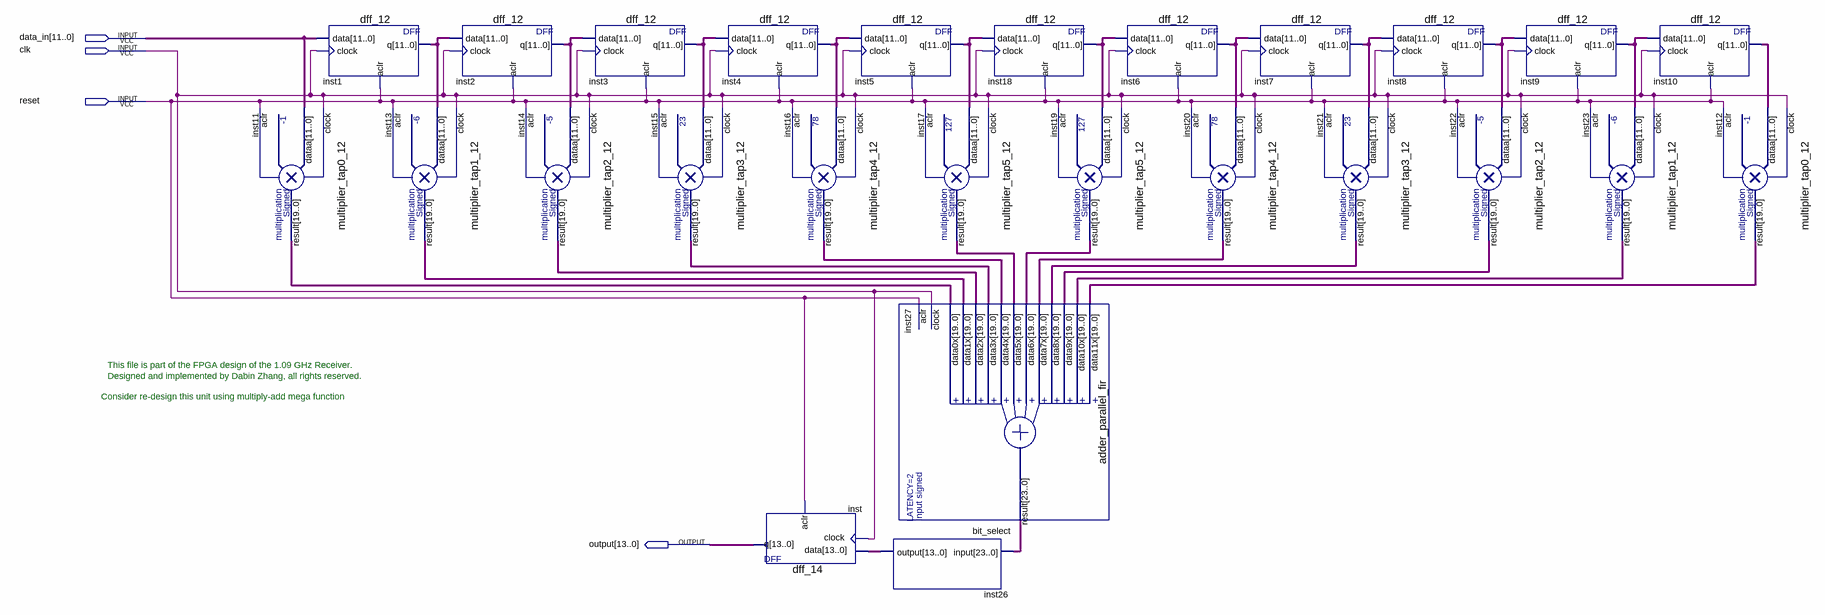
[diagram p0: schematic sheet]
// Quartus schematic fir.bdf as structural Verilog: 26 symbols, 4 pins
module fir (
  input  [11:0] data_in,
  input  clk,
  input  reset,
  output [13:0] \output 
);

  wire [11:0] inst1_q, inst2_q, inst3_q, inst4_q, inst5_q, inst6_q, inst7_q, inst8_q, inst9_q, inst10_q,
       inst18_q;
  wire [13:0] inst26_output;
  wire [19:0] inst11_result, inst12_result, inst13_result, inst14_result, inst15_result, inst16_result,
       inst17_result, inst19_result, inst20_result, inst21_result, inst22_result, inst23_result;
  wire [23:0] inst27_result;

  multiplier_tap0_12 inst11 (.dataa(data_in), .clock(clk), .aclr(reset), .result(inst11_result));
  dff_12 inst1 (.data(data_in), .clock(clk), .aclr(reset), .q(inst1_q));
  multiplier_tap1_12 inst13 (.dataa(inst1_q), .clock(clk), .aclr(reset), .result(inst13_result));
  dff_12 inst2 (.data(inst1_q), .clock(clk), .aclr(reset), .q(inst2_q));
  multiplier_tap2_12 inst14 (.dataa(inst2_q), .clock(clk), .aclr(reset), .result(inst14_result));
  dff_12 inst3 (.data(inst2_q), .clock(clk), .aclr(reset), .q(inst3_q));
  multiplier_tap3_12 inst15 (.dataa(inst3_q), .clock(clk), .aclr(reset), .result(inst15_result));
  dff_12 inst4 (.data(inst3_q), .clock(clk), .aclr(reset), .q(inst4_q));
  multiplier_tap4_12 inst16 (.dataa(inst4_q), .clock(clk), .aclr(reset), .result(inst16_result));
  dff_14 inst (.data(inst26_output), .clock(clk), .aclr(reset), .q(\output ));
  dff_12 inst5 (.data(inst4_q), .clock(clk), .aclr(reset), .q(inst5_q));
  bit_select inst26 (.\input (inst27_result), .\output (inst26_output));
  multiplier_tap5_12 inst17 (.dataa(inst5_q), .clock(clk), .aclr(reset), .result(inst17_result));
  adder_parallel_fir inst27 (
    .data11x(inst12_result), .data10x(inst23_result), .data9x(inst22_result), .data8x(inst21_result),
    .data7x(inst20_result), .data6x(inst19_result), .data5x(inst17_result), .data4x(inst16_result),
    .data3x(inst15_result), .data2x(inst14_result), .data1x(inst13_result), .data0x(inst11_result),
    .clock(clk), .aclr(reset), .result(inst27_result));
  dff_12 inst18 (.data(inst5_q), .clock(clk), .aclr(reset), .q(inst18_q));
  multiplier_tap5_12 inst19 (.dataa(inst18_q), .clock(clk), .aclr(reset), .result(inst19_result));
  dff_12 inst6 (.data(inst18_q), .clock(clk), .aclr(reset), .q(inst6_q));
  multiplier_tap4_12 inst20 (.dataa(inst6_q), .clock(clk), .aclr(reset), .result(inst20_result));
  dff_12 inst7 (.data(inst6_q), .clock(clk), .aclr(reset), .q(inst7_q));
  multiplier_tap3_12 inst21 (.dataa(inst7_q), .clock(clk), .aclr(reset), .result(inst21_result));
  dff_12 inst8 (.data(inst7_q), .clock(clk), .aclr(reset), .q(inst8_q));
  multiplier_tap2_12 inst22 (.dataa(inst8_q), .clock(clk), .aclr(reset), .result(inst22_result));
  dff_12 inst9 (.data(inst8_q), .clock(clk), .aclr(reset), .q(inst9_q));
  multiplier_tap1_12 inst23 (.dataa(inst9_q), .clock(clk), .aclr(reset), .result(inst23_result));
  dff_12 inst10 (.data(inst9_q), .clock(clk), .aclr(reset), .q(inst10_q));
  multiplier_tap0_12 inst12 (.dataa(inst10_q), .clock(clk), .aclr(reset), .result(inst12_result));

  // Notes on the sheet:
  //   This file is part of the FPGA design of the 1.09 GHz Receiver.
  //   Designed and implemented by Dabin Zhang, all rights reserved.
  //   Consider re-design this unit using multiply-add mega function
endmodule
